# EAGLE design Alarm (EAGLE 9.6.2)
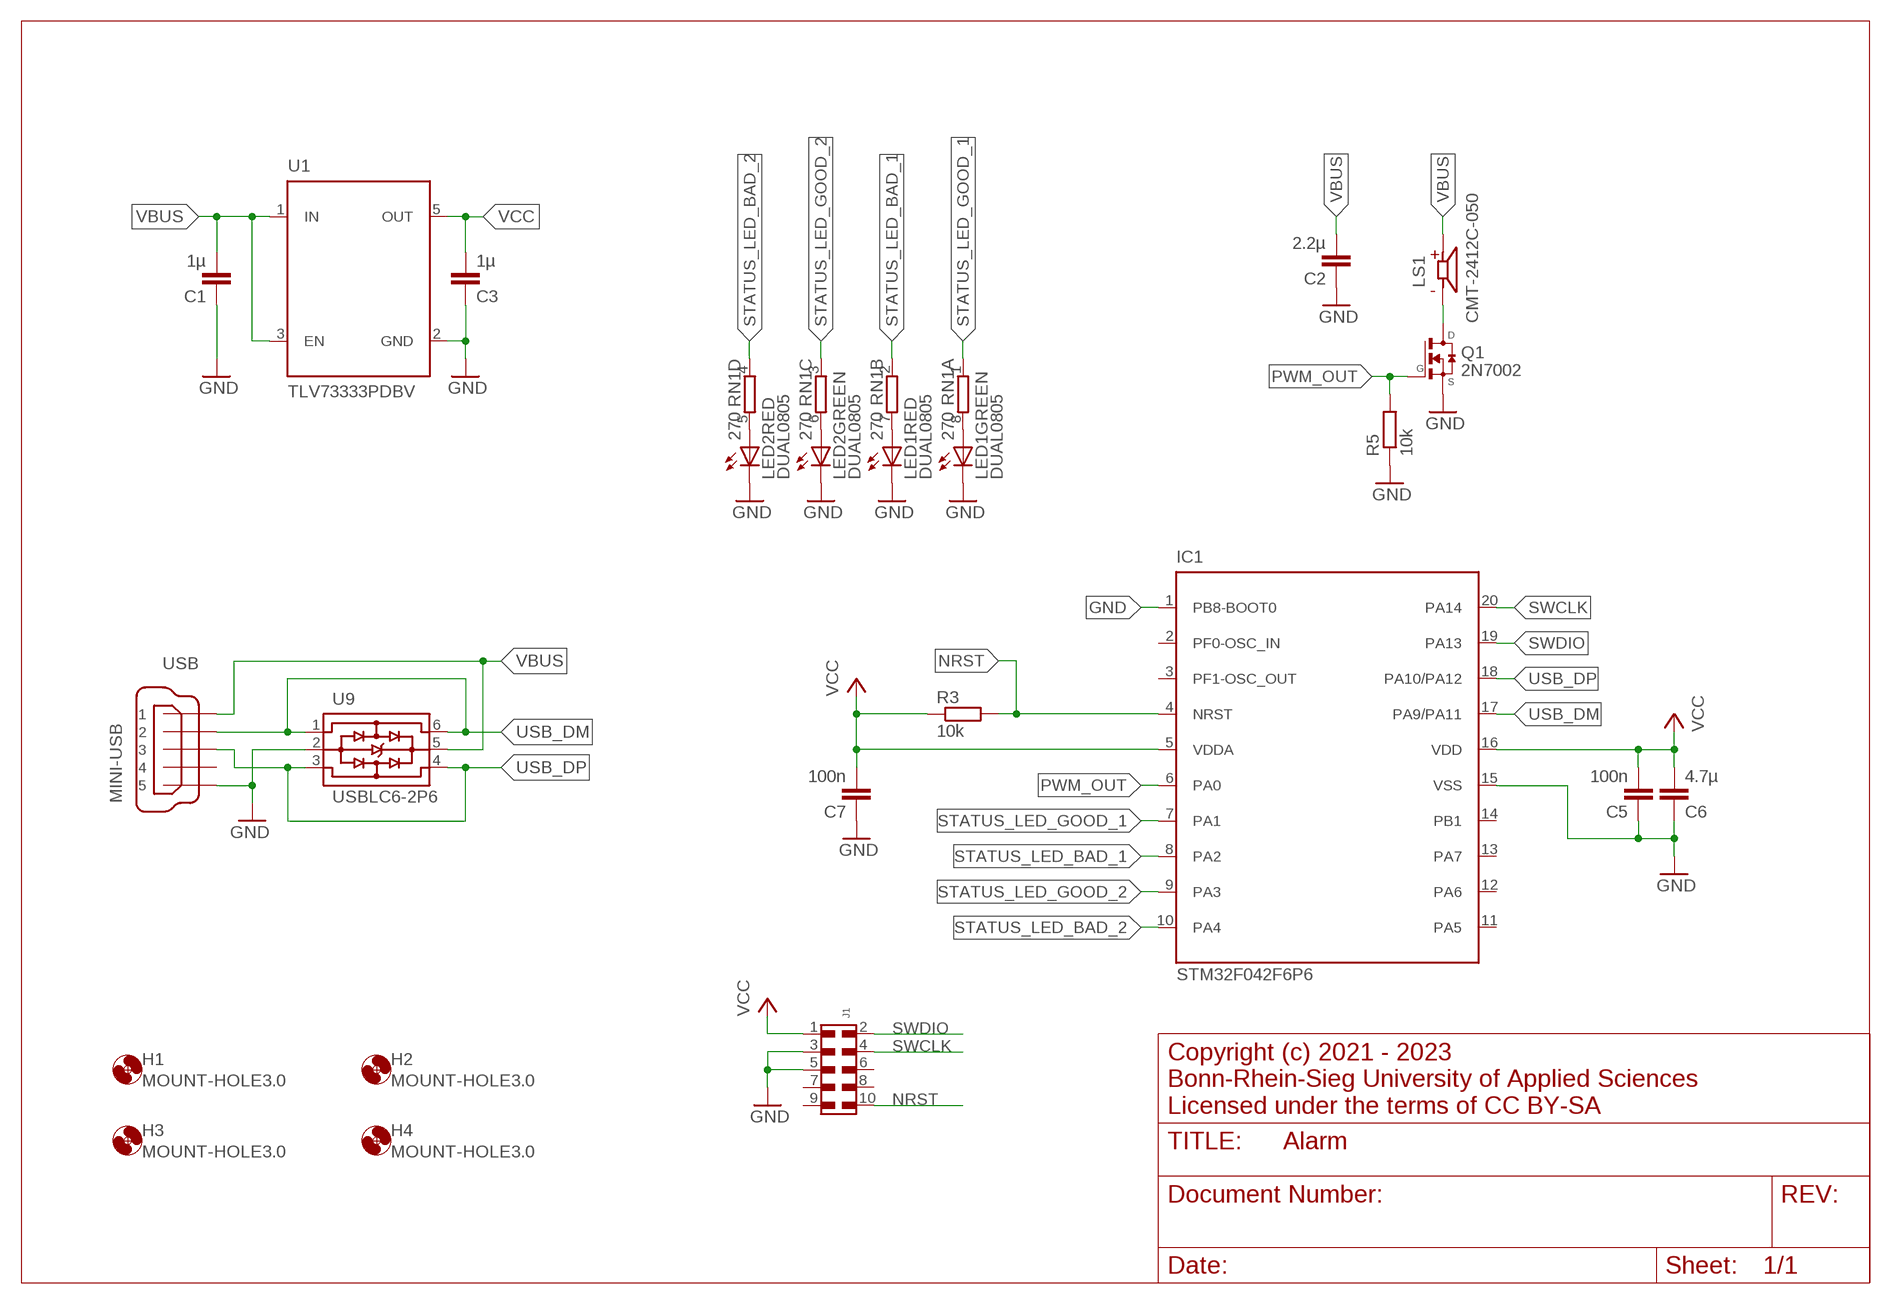
[diagram p0: schematic, sheet 1]

## Parts
C1  1µ  C-EUC0603  [C0603]
C2  2.2µ  C-EUC0603  [C0603]
C3  1µ  C-EUC0603  [C0603]
C5  100n  C-EUC0603  [C0603]
C6  4.7µ  C-EUC0603  [C0603]
C7  100n  C-EUC0603  [C0603]
H1  MOUNT-HOLE3.0  [3,0]
H2  MOUNT-HOLE3.0  [3,0]
H3  MOUNT-HOLE3.0  [3,0]
H4  MOUNT-HOLE3.0  [3,0]
IC1  STM32F042F6P6  [TSSOP20]
J1  6210XX21021_62101021021  [62101021021]
LED1  DUAL0805  [CHIPLEDX2]
LED2  DUAL0805  [CHIPLEDX2]
LS1  CMT-2412C-050  [CUI_CMT-2412C-050]
Q1  2N7002  [SOT23]
R3  10k  R-EU_R0603  [R0603]
R5  10k  R-EU_R0603  [R0603]
RN1  270  4R-NEXB38V  [EXB38V]
U1  TLV73333PDBV  [SOT-23]
U9  USBLC6-2P6  [SOT-666]
USB  MINI-USB  MINI-USB-32005-201  [32005-201]

## Nets
GND: C1.1 C2.1 C3.1 C5.1 C6.1 C7.1 IC1.1(PB8-BOOT0) IC1.15(VSS) J1.3 J1.5 LED1.C1(RED:C) LED1.C2(GREEN:C) LED2.C1(RED:C) LED2.C2(GREEN:C) Q1.2(S) R5.1 U1.2(GND) U9.2 USB.5
N$1: LED2.A1(RED:A) RN1.5
N$2: LED2.A2(GREEN:A) RN1.6
N$3: LED1.A1(RED:A) RN1.7
N$4: LED1.A2(GREEN:A) RN1.8
N$5: LS1.N Q1.3(D)
NRST: IC1.4(NRST) J1.10 R3.2
PWM_OUT: IC1.6(PA0) Q1.1(G) R5.2
STATUS_LED_BAD_1: IC1.8(PA2) RN1.2
STATUS_LED_BAD_2: IC1.10(PA4) RN1.4
STATUS_LED_GOOD_1: IC1.7(PA1) RN1.1
STATUS_LED_GOOD_2: IC1.9(PA3) RN1.3
SWCLK: IC1.20(PA14) J1.4
SWDIO: IC1.19(PA13) J1.2
USB_DM: IC1.17(PA9/PA11) U9.1 U9.6 USB.2
USB_DP: IC1.18(PA10/PA12) U9.3 U9.4 USB.3
VBUS: C1.2 C2.2 LS1.P U1.1(IN) U1.3(EN) U9.5 USB.1
VCC: C3.2 C5.2 C6.2 C7.2 IC1.5(VDDA) IC1.16(VDD) J1.1 R3.1 U1.5(OUT)
Unconnected: IC1.2(PF0-OSC_IN) IC1.3(PF1-OSC_OUT) IC1.11(PA5) IC1.12(PA6) IC1.13(PA7) IC1.14(PB1) J1.6 J1.7 J1.8 J1.9 USB.4

## Notes on the sheet
- Copyright (c) 2021 - 2023
  Bonn-Rhein-Sieg University of Applied Sciences
  Licensed under the terms of CC BY-SA

## Library data of the parts
C1-C3 C5-C7 = rcl:C-EU: CAPACITOR, European symbol; SPICEPREFIX: C
H1-H4 = holes:MOUNT-HOLE: MOUNTING HOLE with drill center marker
IC1 = STM32:STM32F042F*?: ARM®-based 32-bit MCU, up to 32 KB Flash, crystal-less USB FS 2.0, CAN, 9 timers, ADC and comm. interfaces, 2.0 - 3.6 V
J1 = WR-PHD:6210XX21021_62101021021: WR-PHD 1.27 mm SMT Dual Pin Header, H=3.80 mm ARTICLE PROPERTIES: Pins:4;​ 8;​ 10;​ 14;​ 16;​ 20;​ 28;​ 40;​ 44;​ 50 KIND PROPERTIES: Pitch：1.27 mm Quality Class:3 as per CECC 75 301-802 Rows：Dual Gender：Pin Header Type：Straight MATERIAL PROPERTIES: Insulator Material :PA9T Insulator Flammability Rating:UL94 V-0 Contact Material:Copper Alloy Contact Plating:Gold Contact Type:Stamped GENERAL INFORMATION Operating Temperature:-40 up to +105 °C Compliance:Lead free / RoHS ELECTRICAL PROPERTIES: Rated Current:1 A;​ max. IR1:1 A Withstanding Voltage:500 V (AC) Contact Resistance:20 mΩ RISO:1000 MΩ CERTIFICATION UL Approval:E323964 PACKAGING PROPERTIES Packaging:Tube Packaging Unit:228;​ 114;​ 91;​ 65;​ 57;​ 45;​ 32;​ 23;​ 20;​ 18 <https://katalog.we-online.com/media/images/v2/o33195v209%20Family_WR-PDH_621xxx21021.jpg> Details see: https://katalog.we-online.com/en/em/PHD_1_27_SMT_DUAL_PIN_HEADER_6210XX21021 Updated by Yingchun,Shan 2019-10-25 2019 (C) Würth Elektronik; DATASHEET-URL: https://katalog.we-online.com/em/datasheet/62101021021.pdf; GENDER: Pin Header; IR: 1A; MATES: WR-PHD 1.27mm Dual Socket Header/SMT Dual Socket Header,H=4.5mm/SMT Dual Socket Header,H=4.5mm(Reel); PACKAGING: Tube; PART-NUMBER: 62101021021; PINS: 10; ROWS: Dual; TYPE: Straight
LED1 LED2 = DualLED:DUAL0805: Kingbright APHBM2012SURKCGKC (www.digikey.de/product-detail/de/kingbright/APHBM2012SURKCGKC/754-1093-1-ND/1747810)
LS1 = CMT-2412C-050:CMT-2412C-050: 24.5 mm, 5 Vo-p, 89 dB, Through Hole, Magnetic Audio Transducer Buzzer; CUI_PURCHASE_URL: https://www.cui.com/product/audio/buzzers/audio-transducers/magnetic/cmt-2412c-050?utm_source=snapeda.com&utm_medium=referral&utm_campaign=snapedaBOM; DESCRIPTION: CMT Series Ø24.5 x 12.5 mm 0.8 kHz 5 V 89 dBA Magnetic Buzzer Transducer; DIGI-KEY_PART_NUMBER: 102-3765-ND; DIGI-KEY_PURCHASE_URL: https://www.digikey.com/product-detail/en/cui-inc/CMT-2412C-050/102-3765-ND/6012436?utm_source=snapeda&utm_medium=aggregator&utm_campaign=symbol; MF: CUI; MP: CMT-2412C-050; PACKAGE: CUI
Q1 = transistor-fet:2N7002*: N-Channel MOSFET
R3 R5 = rcl:R-EU_: RESISTOR, European symbol; SPICEPREFIX: R
RN1 = resistor-dil:4R-N: Array Chip Resistor Source: RS Component / Phycomp; OC_FARNELL: unknown; OC_NEWARK: unknown
U1 = TLV733P:TLV733*P?: TLV733P Capacitor-Free, 300-mA, Low-Dropout Regulator in 1-mm × 1-mm X2SON Package
U9 = USBLC6-2:USBLC6-2: Very low capacitance ESD protection; PARTNO: *
USB = con-cypressindustries:MINI-USB-: MINI USB-B Conector Source: www.cypressindustries.com; OC_FARNELL: unknown; OC_NEWARK: unknown

## Board
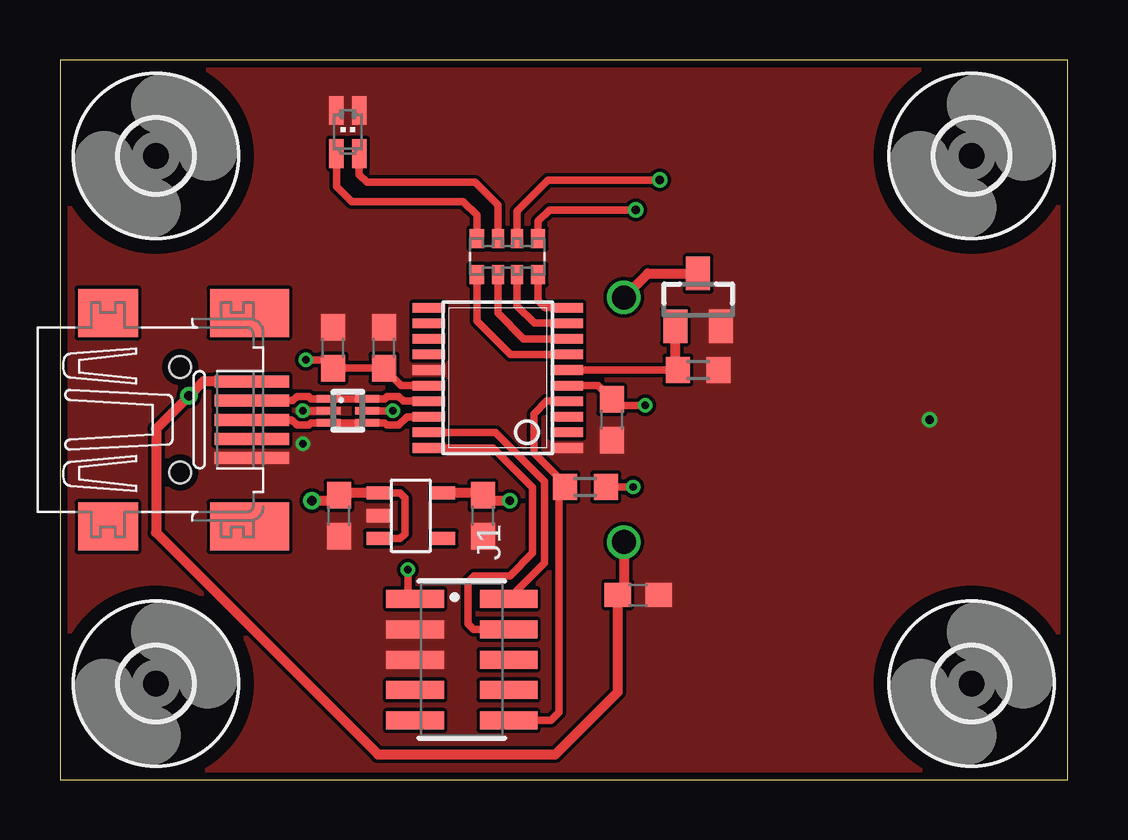
[diagram p1: board, top side]
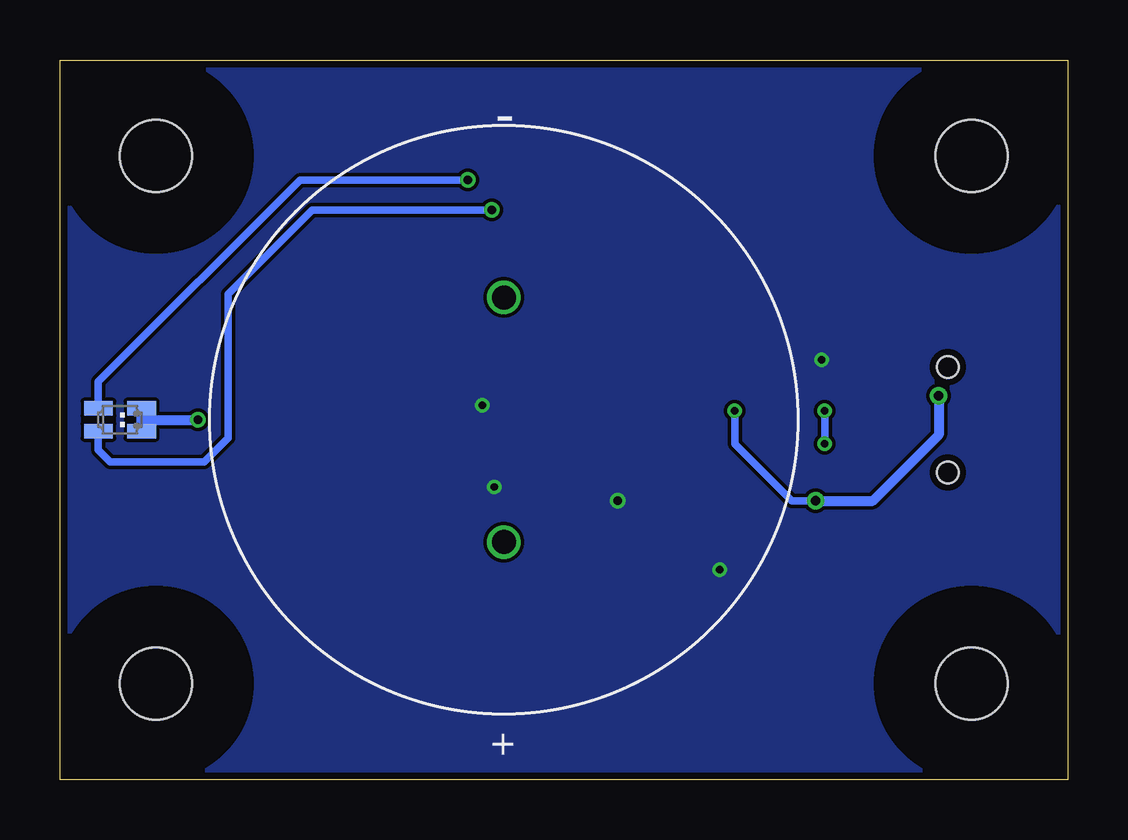
[diagram p2: board, bottom side, seen from below]

Size 42 x 30 mm. Coordinates in mm from the lower left corner, seen from the top.
Outline: 0,0 42,0 42,30 0,30 0,0
Copper layers (1*16): Top 0.035mm / dielectric 1.5mm / Bottom 0.035mm
Design rules "PCB-POOL Standard": minimum track width 0.15mm, minimum drill 0.3mm, track to track 0.15mm, track to pad 0.15mm, pad to pad 0.15mm, via to via 0.15mm, smd to smd 0.15mm, copper to edge 0.3mm, drill to drill 0.2mm, minimum pad ring 0.2mm, minimum via ring 0.15mm, stop-mask expansion 0.075mm, vias tented up to drill 0mil, thermal gap 0.2mm

### Footprints (pad centres in the part's own frame; a part is rotated, then mirrored left to right if it is on the bottom)
C0603 = smd 1.1 x 1: 1 -0.85,0; 2 0.85,0
3,0 = hole 3: 0,0
TSSOP20 = smd 0.4 x 1.35: 1 -2.925,-2.875; 2 -2.275,-2.875; 3 -1.625,-2.875; 4 -0.975,-2.875; 5 -0.325,-2.875; 6 0.325,-2.875; 7 0.975,-2.875; 8 1.625,-2.875; 9 2.275,-2.875; 10 2.925,-2.875; 11 2.925,2.875; 12 2.275,2.875; 13 1.625,2.875; 14 0.975,2.875; 15 0.325,2.875; 16 -0.325,2.875; 17 -0.975,2.875; 18 -1.625,2.875; 19 -2.275,2.875; 20 -2.925,2.875
62101021021 = smd 0.75 x 2.4: 1 -2.54,-1.95; 2 -2.54,1.95; 3 -1.27,-1.95; 4 -1.27,1.95; 5 0,-1.95; 6 0,1.95; 7 1.27,-1.95; 8 1.27,1.95; 9 2.54,-1.95; 10 2.54,1.95
CHIPLEDX2 = smd 0.6 x 1.2: A1 -0.475,0.9; A2 0.475,0.9; C1 -0.475,-0.9; C2 0.475,-0.9
CUI_CMT-2412C-050 = drill 1: N 5.1,0; P -5.1,0
SOT23 = smd 1 x 1.4: 1 -0.95,-1.1; 2 0.95,-1.1; 3 0,1.1
R0603 = smd 1 x 1.1: 1 -0.85,0; 2 0.85,0
EXB38V = smd 0.6 x 0.8: 1 -1.275,-0.75; 4 1.275,-0.75; 5 1.275,0.75; 8 -1.275,0.75 | smd 0.5 x 0.8: 2 -0.4,-0.75; 3 0.4,-0.75; 6 0.4,0.75; 7 -0.4,0.75
SOT-23 = smd 0.55 x 1: 1 -0.95,-1.35; 2 0,-1.35; 3 0.95,-1.35; 4 0.95,1.35; 5 -0.95,1.35
SOT-666 = smd 0.3 x 1: 1 -0.5,-0.81; 2 0,-0.81; 3 0.5,-0.81; 4 0.5,0.81; 5 0,0.81; 6 -0.5,0.81
32005-201 = smd 3.1 x 0.5: 1 3,1.6; 2 3,0.8; 3 3,0; 4 3,-0.8; 5 3,-1.6 | smd 2.5 x 2: M1 -3,-4.45; M2 -3,4.45 | smd 3.3 x 2: M3 2.9,4.45; M4 2.9,-4.45 | hole 0.9: 0,2.2; 0,-2.2

### Placement (x,y rotation side)
C1  11.62,11 90 top
C2  24.1,7.7 180 top
C3  17.62,11 90 top
C5  13.5,18 270 top
C6  11.38,18 270 top
C7  23,15 90 top
H1  4,26 0 top
H2  38,26 0 top
H3  4,4 0 top
H4  38,4 0 top
IC1  18.25,16.75 90 top
J1  16.75,5 270 top
LED1  12,27 180 top
LED2  39.5,15 90 bottom
LS1  23.5,15 90 bottom
Q1  26.6,20 0 top
R3  21.9,12.2 180 top
R5  26.6,17.07 180 top
RN1  18.65,21.8 0 top
U1  14.62,11 270 top
U9  12,15.38 270 top
USB  5,15 0 top

### Tracks (layer width: path | path; a pad name or v marks a point on that pad's centre or on a via)
GND  (via drill 0.3, 0.35)
  Top 0.305: U9.2 v10.12,15.38
  Bottom 0.305: v10.12,15.38 v10.12,14
  Bottom 0.406: LED2.C1 38.6,15 | 38.6,15 LED2.C2 | 38.6,15 v36.25,15
  pour Top (no thermals): 0,30 42,30 42,0 0,0
N$1  (via drill 0.35)
  Top 0.305: RN1.5 19.93,23.27 20.4,23.75 v24,23.75
  Bottom 0.305: LED2.A1 40.4,13.75 39.9,13.25 36,13.25 35,14.25 35,20.25 31.5,23.75 v24,23.75
N$2  (via drill 0.35)
  Top 0.305: RN1.6 19.05,23.7 20.35,25 v25,25
  Bottom 0.305: v25,25 32,25 40.4,16.6 LED2.A2
N$3
  Top 0.305: RN1.7 18.25,23.95 17.3,24.9 12.8,24.9 12.47,25.23 LED1.A1
N$4
  Top 0.305: RN1.8 17.38,23.52 16.8,24.1 12.15,24.1 11.53,24.73 LED1.A2
N$5
  Top 0.406: LS1.N 24.5,21.1 Q1.3
NRST
  Top 0.305: IC1.4 20.27,15.78 19.75,15.25 19.75,13.62 21.05,12.32 R3.2 20.8,11.95 20.8,2.8 20.46,2.46 J1.10
PWM_OUT
  Top 0.305: IC1.6 R5.2
  Top 0.406: R5.2 25.65,17.18 Q1.1
STATUS_LED_BAD_1
  Top 0.305: RN1.2 18.25,19.45 19.32,18.38 IC1.8
STATUS_LED_BAD_2
  Top 0.305: RN1.4 19.93,19.98 20.23,19.68 IC1.10
STATUS_LED_GOOD_1
  Top 0.305: RN1.1 17.38,19.12 18.77,17.73 IC1.7
STATUS_LED_GOOD_2
  Top 0.305: RN1.3 19.05,19.75 19.77,19.02 IC1.9
SWCLK
  Top 0.305: IC1.20 18.05,13.82 19.7,12.18 19.7,9.45 18.75,8.5 17.25,8.5 17,8.25 17,6.5 17.23,6.27 J1.4
SWDIO
  Top 0.305: IC1.19 18.15,14.47 20.2,12.43 20.2,9.04 J1.2
USB_DM
  Top 0.305: USB.2 9.7,15.8 9.88,15.98 10.38,15.98 10.48,15.88 U9.1 U9.6 13.52,15.88 13.62,15.98 14.12,15.98 14.33,15.78 IC1.17
USB_DP
  Top 0.305: USB.3 9.65,15 9.88,14.77 10.38,14.77 10.48,14.88 U9.3 U9.4 13.52,14.88 13.62,14.77 14.12,14.77 14.48,15.12 IC1.18
VBUS  (via drill 0.3, 0.4)
  Top 0.305: U1.3 14.18,10.05 14.38,10.25 14.38,11.75 14.18,11.95 U1.1 | v13.88,15.38 U9.5
  Top 0.406: v10.5,11.62 11.4,11.62 C1.2 | U1.1 11.72,11.95 | USB.1 5.97,16.6 v5.38,16 4,14.62 4,10.3 13.25,1.05 20.65,1.05 23.25,3.65 C2.2 23.5,7.95 LS1.P
  Top 0.508: 11.72,11.95 C1.2
  Bottom 0.305: v13.88,15.38 13.88,14 11.5,11.62 v10.5,11.62
  Bottom 0.406: v5.38,16 5.38,14.38 8.12,11.62 v10.5,11.62
VCC  (via drill 0.3, 0.35)
  Top 0.305: IC1.16 14.32,16.43 14.31,16.43 14.22,16.43 C5.2 C6.2 11.03,17.5 v10.25,17.5 | IC1.5 22.43,16.43 C7.2 23.25,15.6 v24.4,15.6 | R3.1 v23.9,12.2 | J1.1 14.5,7.84 v14.5,8.75
  Top 0.406: 17.52,11.95 U1.5 | v18.75,11.62 17.85,11.62
  Top 0.508: 17.52,11.95 C3.2 17.85,11.62
  pour Bottom (no thermals): 0,30 42,30 42,0 0,0

### Text on the board
tStop: Marcel Hasler / 2022 | ALARM | 1